# EAGLE design esquemático (EAGLE 9.6.2)
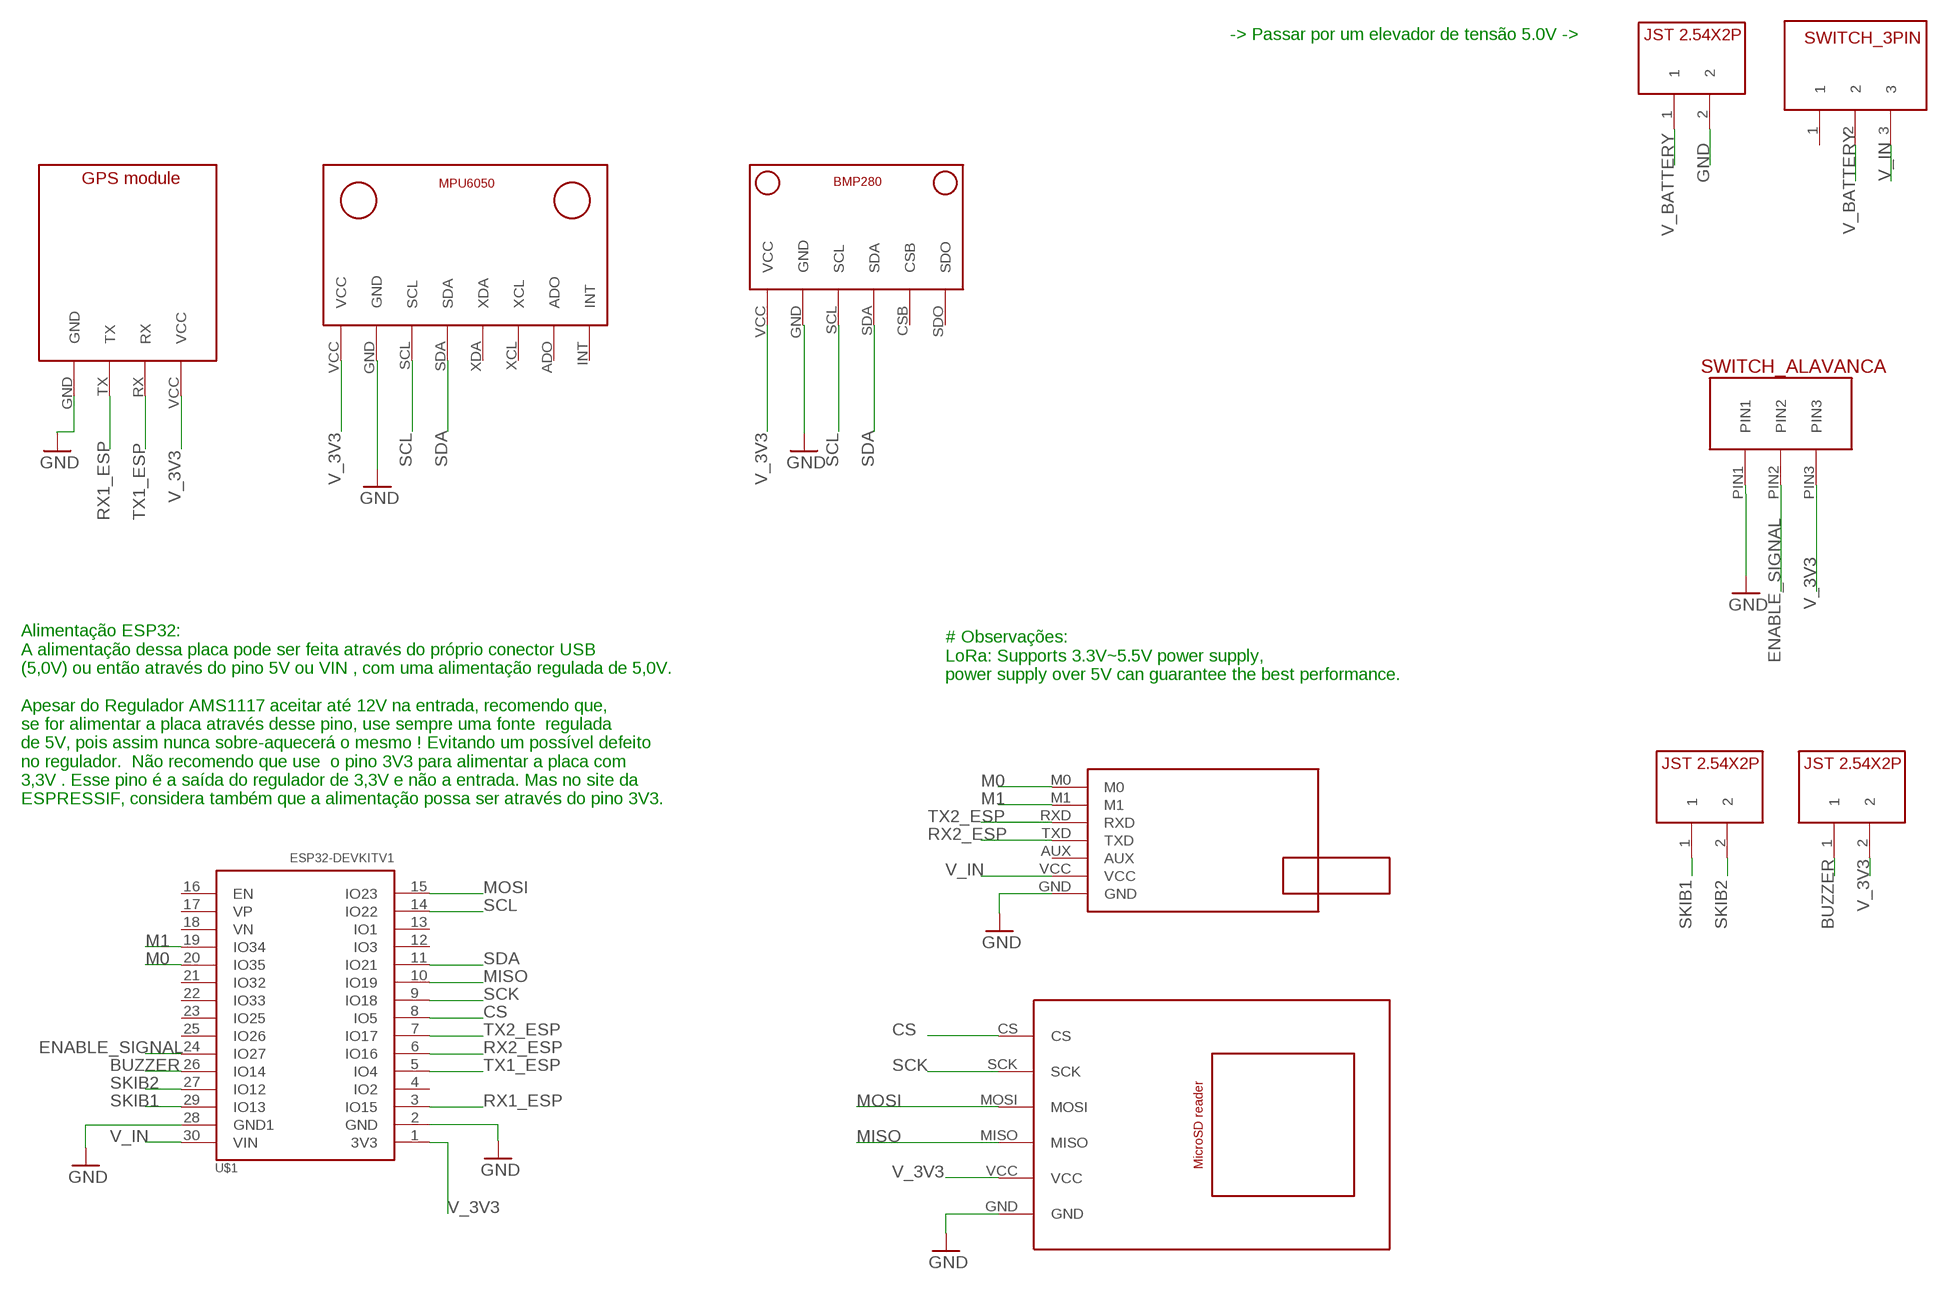
[diagram p0: schematic, sheet 1]

## Parts
U$1  ESP32DEVKITV1  [ESP32-DEVKITV1]
U$2  E22-400T30D  [E22-400T30D_FOOTPRINT]
U$3  GPS_MODULE  [GPS_MODULE_FOOTPRINT]
U$4  BMP280V1  [BMP280_FOOTPRINT]
U$5  SWITCH_ALAVANCA  [SWITCH_ALAVANCA_FOOTPRINT]
U$6  MPU6050V1  [MPU6050_FOOTPRINT]
U$7  MICROSD_READER  [MICROSD_READER_FOOTPRINT]
U$8  JST2.54X2P  [JST2.54X2P_FOOTPRINT]
U$9  JST2.54X2P  [JST2.54X2P_FOOTPRINT]
U$11  SWITCH_3PIN  [SWITCH_3PIN]
U$12  JST2.54X2P  [JST2.54X2P_FOOTPRINT]

## Nets
BUZZER: U$1.26(IO14) U$9.1
CS: U$1.8(IO5) U$7.CS
ENABLE_SIGNAL: U$1.24(IO27) U$5.PIN2
GND: U$1.2(GND) U$1.28(GND1) U$2.GND U$3.GND U$4.GND U$5.PIN1 U$6.GND U$7.GND U$12.2
M0: U$1.20(IO35) U$2.M0
M1: U$1.19(IO34) U$2.M1
MISO: U$1.10(IO19) U$7.MISO
MOSI: U$1.15(IO23) U$7.MOSI
RX1_ESP: U$1.3(IO15) U$3.TX
RX2_ESP: U$1.6(IO16) U$2.TXD
SCK: U$1.9(IO18) U$7.SCK
SCL: U$1.14(IO22) U$4.SCL U$6.SCL
SDA: U$1.11(IO21) U$4.SDA U$6.SDA
SKIB1: U$1.29(IO13) U$8.1
SKIB2: U$1.27(IO12) U$8.2
TX1_ESP: U$1.5(IO4) U$3.RX
TX2_ESP: U$1.7(IO17) U$2.RXD
V_3V3: U$1.1(3V3) U$3.VCC U$4.VCC U$5.PIN3 U$6.VCC U$7.VCC U$9.2
V_BATTERY: U$11.2 U$12.1
V_IN: U$1.30(VIN) U$2.VCC U$11.3
Unconnected: U$1.4(IO2) U$1.12(IO3) U$1.13(IO1) U$1.16(EN) U$1.17(VP) U$1.18(VN) U$1.21(IO32) U$1.22(IO33) U$1.23(IO25) U$1.25(IO26) U$2.AUX U$4.CSB U$4.SDO U$6.ADO U$6.INT U$6.XCL U$6.XDA U$11.1

## Notes on the sheet
- -> Passar por um elevador de tensão 5.0V ->
- # Observações:
  LoRa: Supports 3.3V~5.5V power supply, 
  power supply over 5V can guarantee the best performance.
- Alimentação ESP32:
  A alimentação dessa placa pode ser feita através do próprio conector USB
  (5,0V) ou então através do pino 5V ou VIN , com uma alimentação regulada de 5,0V.
  
  Apesar do Regulador AMS1117 aceitar até 12V na entrada, recomendo que,
  se for alimentar a placa através desse pino, use sempre uma fonte  regulada
  de 5V, pois assim nunca sobre-aquecerá o mesmo ! Evitando um possível defeito
  no regulador.  Não recomendo que use  o pino 3V3 para alimentar a placa com
  3,3V . Esse pino é a saída do regulador de 3,3V e não a entrada. Mas no site da
  ESPRESSIF, considera também que a alimentação possa ser através do pino 3V3.

## Library data of the parts
U$1 = ESP32-DEVKITV1:ESP32DEVKITV1
U$2 = CRD:E22-400T30D
U$3 = CRD:GPS_MODULE
U$4 = CRD:BMP280: Sensor barométrico
U$5 = CRD:SWITCH_ALAVANCA
U$6 = CRD:MPU6050: Acelerômetro e Giroscópio
U$7 = CRD:MICROSD_READER: Leitor e gravador de cartão SD
U$8 U$9 U$12 = CRD:JST2.54X2P: Conector JST 2 pinos (2.54mm de distância entre pinos)
U$11 = CRD:SWITCH_3PIN

## Board
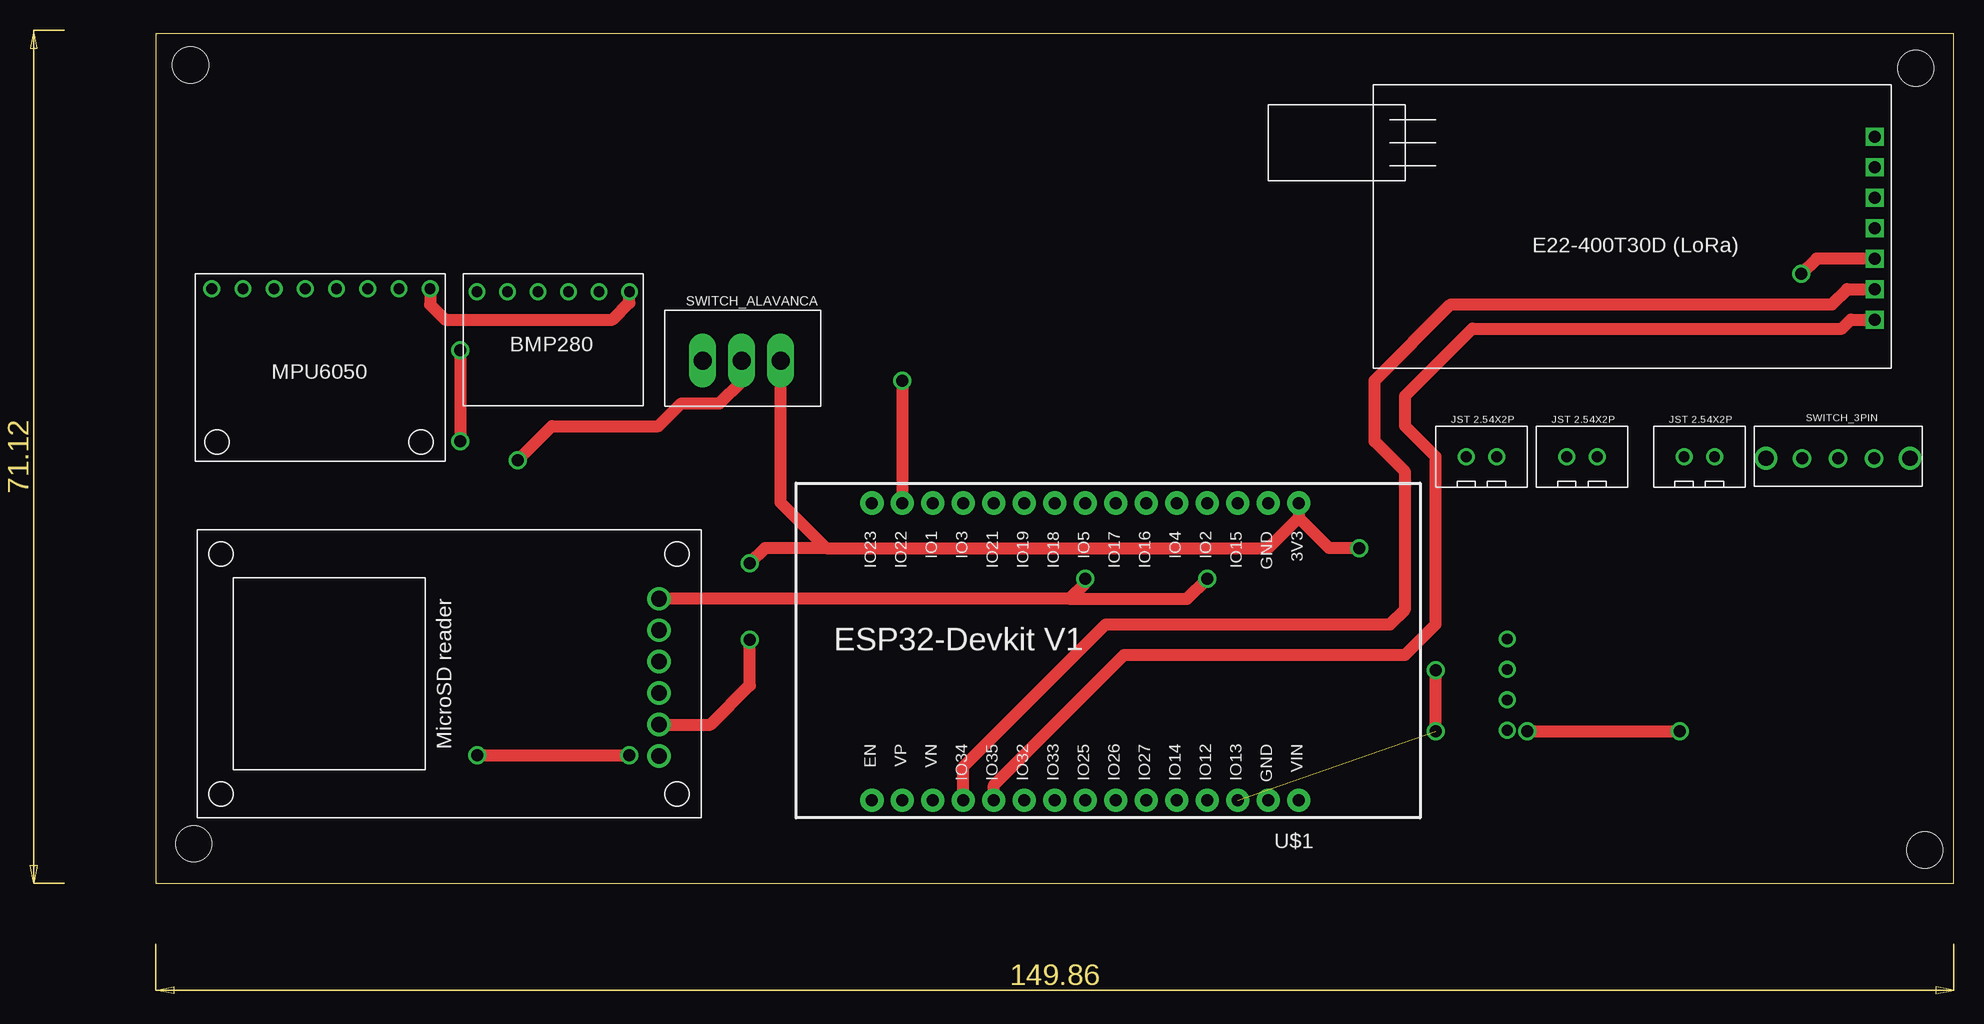
[diagram p1: board, top side]
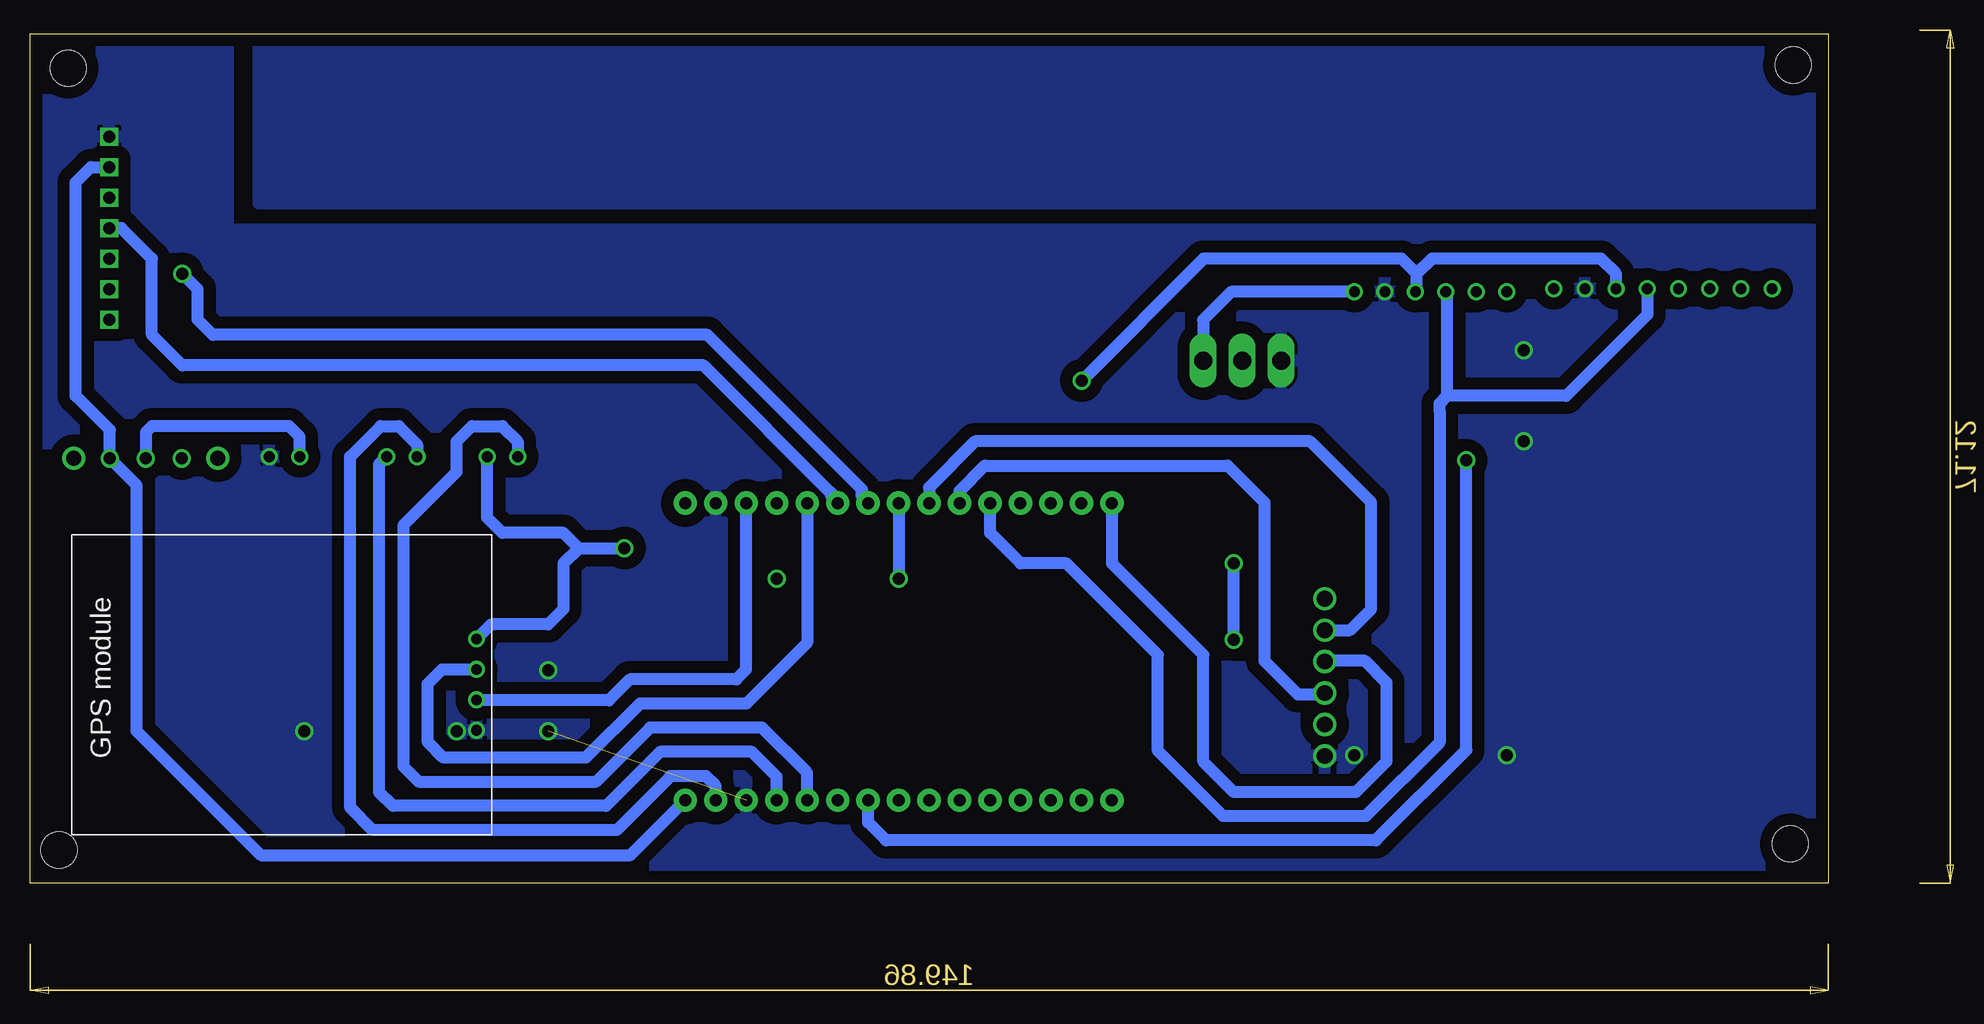
[diagram p2: board, bottom side, seen from below]

Size 149.84 x 70.79 mm. Coordinates in mm from the lower left corner, seen from the top.
Outline: 0,0 149.84,0 149.84,70.79 0,70.79 0,0
Copper layers (1*16): Top 0.035mm / dielectric 1.5mm / Bottom 0.035mm
Design rules "default *": minimum track width 1mm, minimum drill 0.35mm, track to track 40mil, track to pad 0.5mm, pad to pad 6mil, via to via 6mil, smd to smd 6mil, copper to edge 40mil, drill to drill 6mil, minimum pad ring 10mil, minimum via ring 8mil, stop-mask expansion 4mil, vias tented up to drill 0mil, thermal gap 10mil
Holes 3 mm at 2.92,68.2 3.17,3.3 146.69,67.94 147.45,2.79

### Footprints (pad centres in the part's own frame; a part is rotated, then mirrored left to right if it is on the bottom)
ESP32-DEVKITV1 = drill 1 pad 1.93: 1 -22.87,-13.54; 2 -20.33,-13.54; 3 -17.79,-13.54; 4 -15.25,-13.54; 5 -12.71,-13.54; 6 -10.17,-13.54; 7 -7.63,-13.54; 8 -5.09,-13.54; 9 -2.55,-13.54; 10 -0.01,-13.54; 11 2.53,-13.54; 12 5.07,-13.54; 13 7.61,-13.54; 14 10.15,-13.54; 15 12.69,-13.54; 16 12.69,11.23; 17 10.15,11.23; 18 7.61,11.23; 19 5.07,11.23; 20 2.53,11.23; 21 -0.01,11.23; 22 -2.55,11.23; 23 -5.09,11.23; 24 -7.63,11.23; 25 -10.17,11.23; 26 -12.71,11.23; 27 -15.25,11.23; 28 -17.79,11.23; 29 -20.33,11.23; 30 -22.87,11.23
E22-400T30D_FOOTPRINT = drill 1 square: AUX -16.383,-0.762; GND -16.383,-5.842; M0 -16.383,9.398; M1 -16.383,6.858; RXD -16.383,4.318; TXD -16.383,1.778; VCC -16.383,-3.302
GPS_MODULE_FOOTPRINT = drill 0.9: GND -4.01,-16.51; RX 1.07,-16.51; TX -1.47,-16.51; VCC 3.61,-16.51
BMP280_FOOTPRINT = drill 0.891: CSB 3.686,-6.12; GND -3.934,-6.12; SCL -1.395,-6.12; SDA 1.145,-6.12; SDO 6.226,-6.12; VCC -6.474,-6.12
SWITCH_ALAVANCA_FOOTPRINT = drill 1.5 long: PIN1 -3.302,-2.54; PIN2 -0.052,-2.54; PIN3 3.198,-2.54
MPU6050_FOOTPRINT = drill 0.891: ADO 6.686,-10.184; GND -6.314,-10.184; INT 9.286,-10.184; SCL -3.715,-10.184; SDA -1.115,-10.184; VCC -8.915,-10.184; XCL 4.085,-10.184; XDA 1.486,-10.184
MICROSD_READER_FOOTPRINT = drill 1.3: CS 6.449,-8.692; GND -6.651,-8.692; MISO -1.411,-8.692; MOSI 1.209,-8.692; SCK 3.829,-8.692; VCC -4.031,-8.692
JST2.54X2P_FOOTPRINT = drill 0.9: 1 -1.27,0; 2 1.27,0
SWITCH_3PIN = drill 1: 1 -3,-0.018; 2 0,-0.018; 3 3,-0.018 | drill 1.27: P$1 -6,0; P$2 6,0

### Placement (x,y rotation side)
U$1  72.39,18.16 180 top
U$2  126.87,56.39 180 top
U$3  129.16,16.76 90 bottom
U$4  33.02,43.18 180 top
U$5  48.9,46.1 0 top
U$6  13.97,39.37 180 top
U$7  33.27,17.27 90 top
U$8  118.87,35.56 0 top
U$9  110.49,35.56 0 top
U$11  140.21,35.43 0 top
U$12  128.65,35.56 0 top

### Tracks (layer width: path | path; a pad name or v marks a point on that pad's centre or on a via)
ANTENNA
  pour Bottom: 1.27,69.85 1.27,56.64 130.81,56.64 130.81,69.85
BUZZER
  Bottom 1: U$1.26 85.1,9.21 88.87,12.98 98.19,12.98 102.69,8.48 117.47,8.48 118.75,9.75 118.75,29.84 114.3,34.29 114.3,36.83 113.03,38.1 110.49,38.1 109.22,36.83 U$9.1
CS  (via drill 1)
  Top 1: 76.2,23.72 85.95,23.72 v87.63,25.4 | 76.2,23.72 U$7.CS | v77.47,25.4 77.47,24.99 76.2,23.72
  Bottom 1: U$1.8 v77.48,25.41 v77.47,25.4
ENABLE_SIGNAL  (via drill 1)
  Top 1: U$5.PIN2 48.84,41.86 46.99,40.01 43.81,40.01 41.91,38.1 33.02,38.1 v30.17,35.25
  Bottom 1: U$1.24 80.01,5.08 78.52,3.59 37.7,3.59 30.17,11.12 v30.17,35.25
GND  (via drill 1)  (1 unrouted)
  Top 1: v26.8,10.67 v39.5,10.67 | v114.3,12.7 v127,12.7 | v106.68,12.7 v106.68,17.78 | v25.4,44.45 v25.4,36.83
  pour Bottom: 1.27,54.48 133.35,54.48 133.35,69.85 148.59,69.85 148.59,1.27 1.27,1.27
M0
  Top 1: U$1.20 69.86,8.2 80.71,19.05 104.14,19.05 106.68,21.59 106.68,35.56 104.14,38.1 104.14,40.64 109.74,46.24 140.53,46.24 141.28,46.99 U$2.M0
M1
  Top 1: U$2.M1 140.97,49.53 139.7,48.26 107.95,48.26 101.6,41.91 101.6,36.83 104.14,34.29 104.14,22.86 102.87,21.59 79.2,21.59 67.32,9.71 U$1.19
MISO
  Bottom 1: U$1.10 72.4,32.7 70.28,34.81 50.05,34.81 46.99,31.75 46.99,18.54 44.2,15.75 42.08,15.75 U$7.MISO
MOSI
  Bottom 1: U$1.15 59.7,26.68 52.07,19.05 52.07,10.16 49.53,7.62 39.37,7.62 36.83,10.16 36.83,16.76 38.61,18.54 41.91,18.54 U$7.MOSI
RX1_ESP
  Bottom 1: U$3.TX 112.61,15.26 101.62,15.26 99.86,17.01 91,17.01 90.18,17.84 U$1.3
RX2_ESP
  Bottom 1: U$1.6 83.08,32.23 83.08,32.54 93.73,43.18 137.16,43.18 139.7,45.72 139.7,52.07 142.24,54.61 U$2.TXD
SCK
  Bottom 1: U$7.SCK 39.86,21.1 38.1,22.86 38.1,31.75 43.18,36.83 71.12,36.83 74.94,33.01 U$1.9
SCL  (via drill 1)
  Top 1: v62.23,41.91 v62.24,41.9 U$1.14
  Bottom 1: U$4.SCL 34.29,49.42 34.29,50.8 | 34.29,50.8 33.02,52.07 18.95,52.07 17.68,50.8 U$6.SCL | 34.29,50.8 35.56,52.07 52.07,52.07 v62.23,41.91
SDA
  Bottom 1: 31.75,40.64 31.75,49.17 U$4.SDA | U$6.SDA 15.09,47.4 21.84,40.64 31.75,40.64 | U$1.11 69.86,29.22 67.31,26.67 63.5,26.67 55.88,19.05 55.88,11.05 50.44,5.6 38.53,5.6 32.4,11.74 32.4,39.37 32.4,39.99 31.75,40.64
SKIB1
  Bottom 1: U$1.29 92.72,8.14 93.53,8.95 96.52,8.95 96.52,8.89 100.97,4.45 121.28,4.45 123.19,6.35 123.19,35.56 120.65,38.1 119.13,38.1 117.6,36.58 U$8.1
SKIB2
  Bottom 1: U$1.27 87.64,8.9 89.7,10.96 97.36,10.96 101.86,6.46 119.62,6.46 120.78,7.62 120.78,34.92 U$8.2
TX1_ESP
  Bottom 1: U$1.5 85.1,20.07 90.17,14.99 99.03,14.99 103.53,10.49 115.41,10.49 116.73,11.81 116.73,16.62 115.52,17.83 U$3.RX
TX2_ESP  (via drill 1)
  Top 1: U$2.RXD 138.43,52.07 v137.16,50.8
  Bottom 1: U$1.7 80.54,32.23 80.54,32.85 93.42,45.72 134.62,45.72 135.89,46.99 135.89,49.53 v137.16,50.8
V_3V3  (via drill 1)
  Top 1: v100.33,27.94 97.79,27.94 95.25,30.48 | U$7.VCC 46.26,13.24 49.53,16.51 v49.53,20.32 | 55.88,27.94 50.8,27.94 v49.53,26.67 | 55.88,27.94 52.09,31.73 U$5.PIN3 | U$1.1 95.25,30.48 | 95.25,30.48 92.71,27.94 55.88,27.94 | U$6.VCC 22.88,48.24 24.13,46.99 38.1,46.99 39.49,48.38 U$4.VCC
  Bottom 1: U$9.2 111.76,30.48 110.49,29.21 105.41,29.21 104.14,27.94 | 104.14,27.94 105.41,26.67 105.41,22.86 106.68,21.59 111.43,21.59 U$3.VCC | 104.14,27.94 v100.33,27.94 | v49.53,20.32 v49.53,26.67 | U$5.PIN3 52.09,46.97 49.76,49.3 U$4.VCC
V_BATTERY
  Bottom 1: U$12.1 127.38,37.21 128.27,38.1 139.7,38.1 140.21,37.59 U$11.2
V_IN
  Bottom 1: U$1.30 99.83,2.36 130.63,2.36 140.97,12.7 140.97,33.18 U$11.3 143.21,37.8 146.05,40.64 146.05,58.42 144.78,59.69 U$2.VCC